# EAGLE design transmitter4 (EAGLE 5.10)
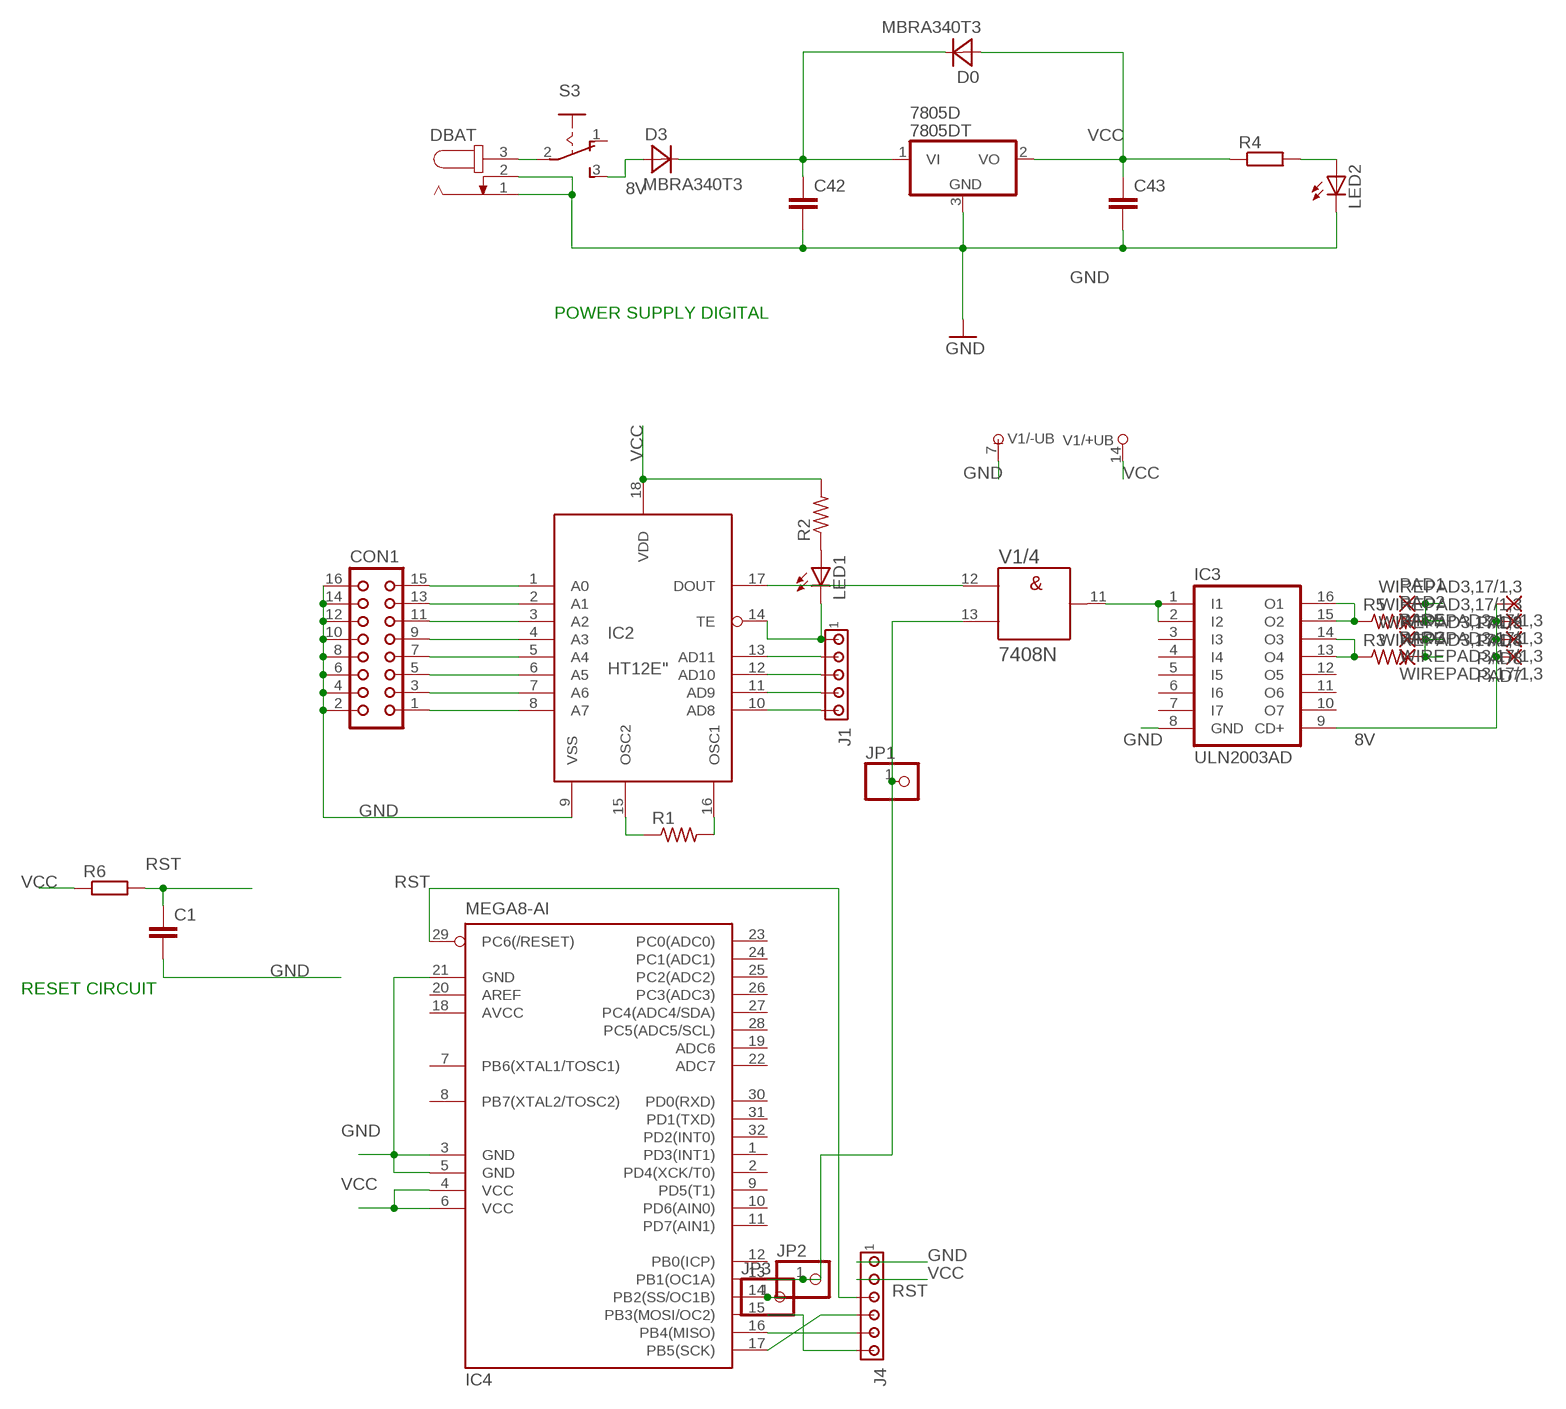
[diagram p0: schematic, sheet 1]

## Parts
7805D  7805DT  [TO252]
C1  C-EUC0603  [C0603]
C42  C-EUC0603  [C0603]
C43  C-EUC0603  [C0603]
CON1  CON16  [CON16]
D0  MBRA340T3  [SMA]
D3  MBRA340T3  [SMA]
DBAT  JACK-PLUG0  [SPC4077]
IC2  HT12E"  [18-DIP-A]
IC3  ULN2003AD  [SO16]
IC4  MEGA8-AI  [TQFP32-08]
J1  MTA05-100  [10X05MTA]
J4  MTA06-100  [10X06MTA]
JP1  PINHD-1X1  [1X01]
JP2  PINHD-1X1  [1X01]
JP3  PINHD-1X1  [1X01]
LED1  LED3MM  [LED3MM]
LED2  LED3MM  [LED3MM]
PAD1  WIREPAD3,17/1,3  [3,17/1,3]
PAD2  WIREPAD3,17/1,3  [3,17/1,3]
PAD3  WIREPAD3,17/1,3  [3,17/1,3]
PAD4  WIREPAD3,17/1,3  [3,17/1,3]
PAD5  WIREPAD3,17/1,3  [3,17/1,3]
PAD7  WIREPAD3,17/1,3  [3,17/1,3]
PAD8  WIREPAD3,17/1,3  [3,17/1,3]
PAD9  WIREPAD3,17/1,3  [3,17/1,3]
R1  R-US_VMTA55  [VMTA55]
R2  R-US_M1206  [M1206]
R3  R-US_0309/12  [0309/12]
R4  R-EU_R0603  [R0603]
R5  R-US_0309/12  [0309/12]
R6  R-EU_R0603  [R0603]
S3  255SB  [255SB]
V1  7408N  [DIL14]

## Nets
8V: D3.A IC3.9(CD+) PAD4.1(P) PAD7.1(P) PAD8.1(P) PAD9.1(P) S3.3(S)
GND: 7805D.3(GND) C1.2 C42.2 C43.2 CON1.2 CON1.4 CON1.6 CON1.8 CON1.10 CON1.12 CON1.14 CON1.16 DBAT.1 DBAT.2 IC2.9(VSS) IC3.8(GND) IC4.3(GND) IC4.5(GND) IC4.21(GND) J4.6 LED2.K(C) V1.7(/-UB:-UB)
N$1: CON1.15 IC2.1(A0)
N$2: CON1.13 IC2.2(A1)
N$3: CON1.11 IC2.3(A2)
N$4: CON1.9 IC2.4(A3)
N$5: CON1.7 IC2.5(A4)
N$6: DBAT.3 S3.2(P)
N$7: IC3.15(O2) IC3.16(O1) R5.1
N$8: LED2.A R4.2
N$9: CON1.5 IC2.6(A5)
N$10: CON1.3 IC2.7(A6)
N$11: CON1.1 IC2.8(A7)
N$12: IC2.13(AD11) J1.2
N$13: IC2.12(AD10) J1.3
N$14: IC2.11(AD9) J1.4
N$15: IC2.10(AD8) J1.5
N$16: IC2.16(OSC1) R1.2
N$17: IC2.15(OSC2) R1.1
N$18: IC4.13(PB1(OC1A)) JP1.1 JP2.1 V1.13(/4:B)
N$19: IC4.14(PB2(SS/OC1B)) JP3.1
N$20: IC3.13(O4) IC3.14(O3) R3.1
N$21: PAD3.1(P) PAD5.1(P) R3.2
N$22: IC2.17(DOUT) V1.12(/4:A)
N$24: LED1.A R2.1
N$25: IC3.1(I1) IC3.2(I2) V1.11(/4:Y)
N$26: IC4.15(PB3(MOSI/OC2)) J4.1
N$27: PAD1.1(P) PAD2.1(P) R5.2
N$28: IC4.16(PB4(MISO)) J4.2
N$29: IC4.17(PB5(SCK)) J4.3
RST: C1.1 IC4.29(PC6(/RESET)) J4.4 R6.2
TE: IC2.14(TE) J1.1 LED1.K(C)
VCC: 7805D.2(VO) C43.1 D0.A IC2.18(VDD) IC4.4(VCC) IC4.6(VCC) J4.5 R2.2 R4.1 R6.1 V1.14(/+UB:+UB)
VI(5D): 7805D.1(VI) C42.1 D0.C D3.C
Unconnected: IC3.3(I3) IC3.4(I4) IC3.5(I5) IC3.6(I6) IC3.7(I7) IC3.10(O7) IC3.11(O6) IC3.12(O5) IC4.1(PD3(INT1)) IC4.2(PD4(XCK/T0)) IC4.7(PB6(XTAL1/TOSC1)) IC4.8(PB7(XTAL2/TOSC2)) IC4.9(PD5(T1)) IC4.10(PD6(AIN0)) IC4.11(PD7(AIN1)) IC4.12(PB0(ICP)) IC4.19(ADC6) IC4.20(AREF) IC4.22(ADC7) IC4.23(PC0(ADC0)) IC4.24(PC1(ADC1)) IC4.25(PC2(ADC2)) IC4.26(PC3(ADC3)) IC4.27(PC4(ADC4/SDA)) IC4.28(PC5(ADC5/SCL)) IC4.30(PD0(RXD)) IC4.31(PD1(TXD)) IC4.32(PD2(INT0)) S3.1(O) V1.1(/1:A) V1.2(/1:B) V1.3(/1:Y) V1.4(/2:A) V1.5(/2:B) V1.6(/2:Y) V1.8(/3:Y) V1.9(/3:A) V1.10(/3:B)

## Notes on the sheet
- POWER SUPPLY DIGITAL
- RESET CIRCUIT

## Power pins joined to a net without a drawn wire
AVCC: IC4.18(AVCC)

## Library data of the parts
7805D = linear:78*: Positive VOLTAGE REGULATOR Source: http://cache.national.com/ds/LM/LM78L05.pdf http://www.fairchildsemi.com/ds/LM/LM7805.pdf
C1 C42 C43 = rcl:C-EU: CAPACITOR, European symbol
CON1 = con-harting:CON16: CONNECTOR
D0 D3 = diode:MBRA340T3: Surface Mount Schottky Power Rectifier Source: http://www.onsemi.com/pub_link/Collateral/MBRA340T3-D.PDF
DBAT = con-jack:JACK-PLUG: DC POWER JACK Power Jack, DC, Right Angle, Through Hole, Rated 5A at 16VDC, PC Terminals Distributor: Farnell (www.Farnell.de) Drawing: 84N1161.pdf / 84N1162.pdf Manufacturer: SPC Technology (www.spctechnology.com) Type: SPC4077 / SPC 4078
IC2 = holtek (2):HT12E: transmitter = encoder ic
IC3 = uln-udn:ULN2003A: DRIVER ARRAY
IC4 = atmel:MEGA8: MICROCONTROLLER 8 Kbytes FLASH, 1 kbytes SRAM, 512 bytes EEPROM, USART, 6-channel 10 bit ADC, 2-channel 8 bit ADC Pin compatible with Atmega48, ATMega88, ATMega168 Source: avr.lbr
J1 = con-amp:MTA05-100: AMP connector
J4 = con-amp:MTA06-100: AMP connector
JP1-JP3 = pinhead:PINHD-1X1: PIN HEADER
LED1 LED2 = led:LED: LED OSRAM: - CHIPLED LG R971, LG N971, LY N971, LG Q971, LY Q971, LO R971, LY R971 LH N974, LH R974 LS Q976, LO Q976, LY Q976 LO Q996 - Hyper CHIPLED LW Q18S LB Q993, LB Q99A, LB R99A - SideLED LS A670, LO A670, LY A670, LG A670, LP A670 LB A673, LV A673, LT A673, LW A673 LH A674 LY A675 LS A676, LA A676, LO A676, LY A676, LW A676 LS A679, LY A679, LG A679 - Hyper Micro SIDELED® LS Y876, LA Y876, LO Y876, LY Y876 LT Y87S - SmartLED LW L88C, LW L88S LB L89C, LB L89S, LG L890 LS L89K, LO L89K, LY L89K LS L896, LA L896, LO L896, LY L896 - TOPLED LS T670, LO T670, LY T670, LG T670, LP T670 LSG T670, LSP T670, LSY T670, LOP T670, LYG T670 LG T671, LOG T671, LSG T671 LB T673, LV T673, LT T673, LW T673 LH T674 LS T676, LA T676, LO T676, LY T676, LB T676, LH T676, LSB T676, LW T676 LB T67C, LV T67C, LT T67C, LS T67K, LO T67K, LY T67K, LW E67C LS E67B, LA E67B, LO E67B, LY E67B, LB E67C, LV E67C, LT E67C LW T67C LS T679, LY T679, LG T679 LS T770, LO T770, LY T770, LG T770, LP T770 LB T773, LV T773, LT T773, LW T773 LH T774 LS E675, LA E675, LY E675, LS T675 LS T776, LA T776, LO T776, LY T776, LB T776 LHGB T686 LT T68C, LB T68C - Hyper Mini TOPLED® LB M676 - Mini TOPLED Santana® LG M470 LS M47K, LO M47K, LY M47K Source: http://www.osram.convergy.de LUXEON: - LUMILED® LXK2-PW12-R00, LXK2-PW12-S00, LXK2-PW14-U00, LXK2-PW14-V00 LXK2-PM12-R00, LXK2-PM12-S00, LXK2-PM14-U00 LXK2-PE12-Q00, LXK2-PE12-R00, LXK2-PE12-S00, LXK2-PE14-T00, LXK2-PE14-U00 LXK2-PB12-K00, LXK2-PB12-L00, LXK2-PB12-M00, LXK2-PB14-N00, LXK2-PB14-P00, LXK2-PB14-Q00 LXK2-PR12-L00, LXK2-PR12-M00, LXK2-PR14-Q00, LXK2-PR14-R00 LXK2-PD12-Q00, LXK2-PD12-R00, LXK2-PD12-S00 LXK2-PH12-R00, LXK2-PH12-S00 LXK2-PL12-P00, LXK2-PL12-Q00, LXK2-PL12-R00 Source: www.luxeon.com KINGBRIGHT: KA-3528ASYC Source: www.kingbright.com
PAD1-PAD5 PAD7-PAD9 = wirepad:WIREPAD: Wire PAD connect wire on PCB
R1-R3 R5 = rcl:R-US_: RESISTOR, American symbol
R4 R6 = resistor:R-EU_: RESISTOR, European symbol
S3 = switch:255SB: SLIDING SWITCH Distributor Buerklin, 11G810
V1 = 74ttl-din:74*08: Quad 2-input AND gate

## Board
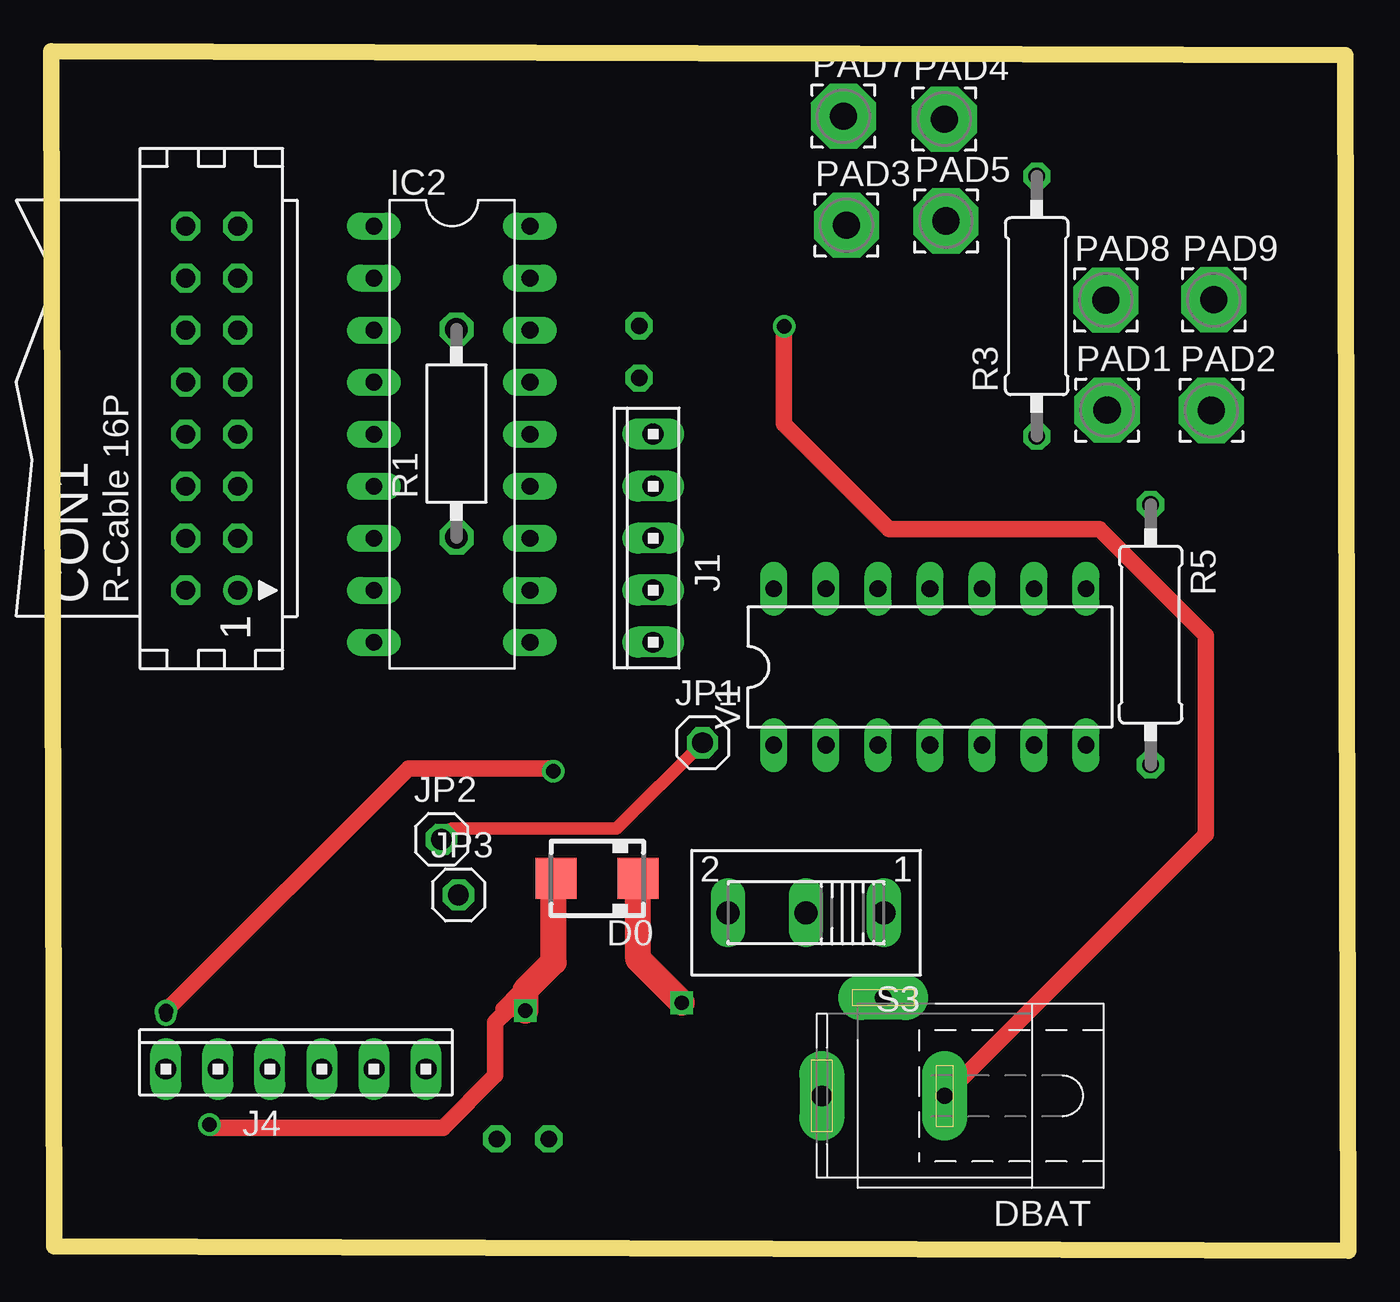
[diagram p1: board, top side]
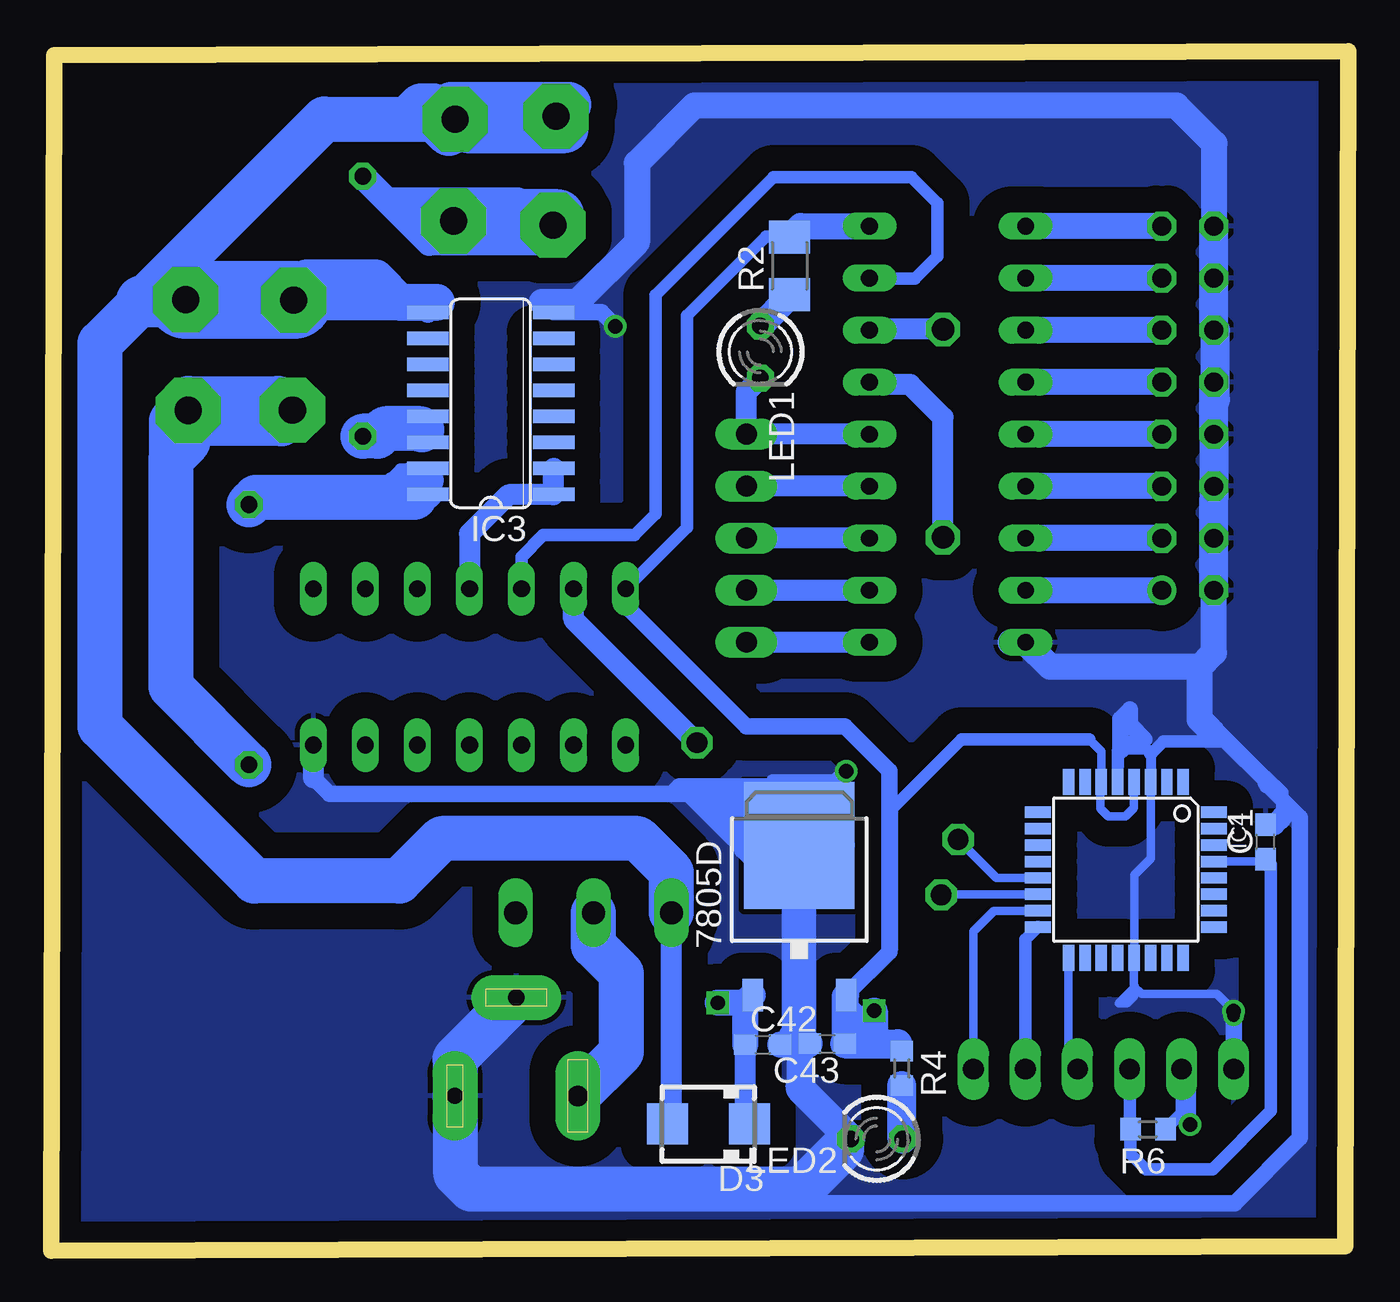
[diagram p2: board, bottom side, seen from below]

Size 63.32 x 58.55 mm. Coordinates in mm from the lower left corner, seen from the top.
Outline: 0.16,0.2 63.32,0 63.16,58.35 0,58.55 0.16,0.2
Copper layers (1*16): Top 0.035mm / dielectric 1.5mm / Bottom 0.035mm
Design rules "default *": minimum track width 10mil, minimum drill 24mil, track to track 50mil, track to pad 50mil, pad to pad 50mil, via to via 50mil, smd to smd 50mil, copper to edge 40mil, drill to drill 8mil, minimum pad ring 10mil, minimum via ring 8mil, stop-mask expansion 4mil, vias tented up to drill 0mil, thermal gap 10mil

### Footprints (pad centres in the part's own frame; a part is rotated, then mirrored left to right if it is on the bottom)
TO252 = smd 1 x 1.6: 1 -2.28,-4.8; 2 2.28,-4.8 | smd 5.4 x 6.2: 3 0,2.5
C0603 = smd 1.1 x 1: 1 -0.85,0; 2 0.85,0
CON16 = drill 0.914 round: 1 -8.89,-1.27 | drill 0.914 octagon: 2 -8.89,1.27; 3 -6.35,-1.27; 4 -6.35,1.27; 5 -3.81,-1.27; 6 -3.81,1.27; 7 -1.27,-1.27; 8 -1.27,1.27; 9 1.27,-1.27; 10 1.27,1.27; 11 3.81,-1.27; 12 3.81,1.27; 13 6.35,-1.27; 14 6.35,1.27; 15 8.89,-1.27; 16 8.89,1.27
SMA = smd 2 x 2: A 2,0; C -2,0
SPC4077 = drill 0.8 pad 2.184 long: 1 -3,0; 2 0,-4.8 | drill 1 pad 2.184 long: 3 3,0
18-DIP-A = drill 0.813 long: 1 -10.16,-3.81; 2 -7.62,-3.81; 3 -5.08,-3.81; 4 -2.54,-3.81; 5 0,-3.81; 6 2.54,-3.81; 7 5.08,-3.81; 8 7.62,-3.81; 9 10.16,-3.81; 10 10.16,3.81; 11 7.62,3.81; 12 5.08,3.81; 13 2.54,3.81; 14 0,3.81; 15 -2.54,3.81; 16 -5.08,3.81; 17 -7.62,3.81; 18 -10.16,3.81
SO16 = smd 0.66 x 2.032: 1 -4.445,-3.073; 2 -3.175,-3.073; 3 -1.905,-3.073; 4 -0.635,-3.073; 5 0.635,-3.073; 6 1.905,-3.073; 7 3.175,-3.073; 8 4.445,-3.073; 9 4.445,3.073; 10 3.175,3.073; 11 1.905,3.073; 12 0.635,3.073; 13 -0.635,3.073; 14 -1.905,3.073; 15 -3.175,3.073; 16 -4.445,3.073
TQFP32-08 = smd 1.27 x 0.559: 1 -4.293,2.8; 2 -4.293,2; 3 -4.293,1.2; 4 -4.293,0.4; 5 -4.293,-0.4; 6 -4.293,-1.2; 7 -4.293,-2; 8 -4.293,-2.8; 17 4.293,-2.8; 18 4.293,-2; 19 4.293,-1.2; 20 4.293,-0.4; 21 4.293,0.4; 22 4.293,1.2; 23 4.293,2; 24 4.293,2.8 | smd 0.559 x 1.27: 9 -2.8,-4.293; 10 -2,-4.293; 11 -1.2,-4.293; 12 -0.4,-4.293; 13 0.4,-4.293; 14 1.2,-4.293; 15 2,-4.293; 16 2.8,-4.293; 25 2.8,4.293; 26 2,4.293; 27 1.2,4.293; 28 0.4,4.293; 29 -0.4,4.293; 30 -1.2,4.293; 31 -2,4.293; 32 -2.8,4.293
10X05MTA = drill 1.016 long: 1 5.08,0; 2 2.54,0; 3 0,0; 4 -2.54,0; 5 -5.08,0
10X06MTA = drill 1.016 long: 1 6.35,0; 2 3.81,0; 3 1.27,0; 4 -1.27,0; 5 -3.81,0; 6 -6.35,0
1X01 = drill 1.016 octagon: 1 0,0
LED3MM = drill 0.813 octagon: A -1.27,0; K 1.27,0
3,17/1,3 = drill 1.321 pad 3.175 octagon: 1 0,0
VMTA55 = drill 1.1 octagon: 1 -5.08,0; 2 5.08,0
M1206 = smd 1.6 x 2: 1 -1.4,0; 2 1.4,0
0309/12 = drill 0.813 octagon: 1 -6.35,0; 2 6.35,0
R0603 = smd 1 x 1.1: 1 -0.85,0; 2 0.85,0
255SB = drill 1.118 long: 1 -3.81,0; 2 0,0; 3 3.81,0
DIL14 = drill 0.813 long: 1 -7.62,-3.81; 2 -5.08,-3.81; 3 -2.54,-3.81; 4 0,-3.81; 5 2.54,-3.81; 6 5.08,-3.81; 7 7.62,-3.81; 8 7.62,3.81; 9 5.08,3.81; 10 2.54,3.81; 11 0,3.81; 12 -2.54,3.81; 13 -5.08,3.81; 14 -7.62,3.81

### Placement (x,y rotation side)
7805D  26.8,17.27 0 bottom
C1  4.03,19.95 90 bottom
C42  28.58,10.05 0 bottom
C43  25.44,10.09 180 bottom
CON1  7.83,41.12 90 top
D0  26.65,18.17 180 top
D3  31.24,6.18 180 bottom
DBAT  40.61,7.55 180 top
IC2  19.56,39.85 270 top
IC3  41.86,41.36 90 bottom
IC4  10.86,18.59 270 bottom
J1  29.39,34.78 90 top
J4  11.95,8.86 0 top
JP1  31.79,24.79 0 top
JP2  19.05,20.07 0 top
JP3  19.88,17.36 0 top
LED1  28.7,43.87 270 bottom
LED2  23.02,5.45 180 bottom
PAD1  51.54,41.03 0 top
PAD2  56.63,41.02 0 top
PAD3  38.82,50.06 0 top
PAD4  43.6,55.24 0 top
PAD5  43.68,50.26 0 top
PAD7  38.67,55.38 0 top
PAD8  51.48,46.41 0 top
PAD9  56.75,46.41 0 top
R1  19.79,39.89 90 top
R2  27.27,48.07 90 bottom
R3  48.11,46.1 90 top
R4  21.8,8.89 270 bottom
R5  53.67,30.06 270 top
R6  9.78,5.92 180 bottom
S3  36.85,16.49 180 top
V1  42.9,28.49 0 top

### Tracks (layer width: path | path; a pad name or v marks a point on that pad's centre or on a via)
8V
  Bottom 1.016: 51.47,46.3 45.43,46.3 IC3.9 | D3.A 33.04,6.38 S3.3
  Bottom 1.676: 50.9,46.95 50.9,47.44 50.85,47.49
  Bottom 1.778: 50.85,47.49 47.49,47.49 46.28,46.28 44.52,46.28 44.5,46.3 51.47,46.3
  Bottom 2.184: 56.82,46.34 PAD9.1 | PAD4.1 49.99,55.24 58.89,46.34 60.93,44.3 60.93,25.58 53.39,18.04 46.33,18.04 44.26,20.11 34.68,20.11 33.04,18.47 S3.3 | PAD4.1 44.01,55.24 44.64,55.87 45.28,55.87 45.58,55.57 44.96,55.57 43.92,54.53 43.92,55.81 43.78,55.95 38.06,55.95 | PAD7.1 38.19,54.7 38.22,54.67 43.03,54.67 PAD4.1
  Bottom 2.54: 58.89,46.34 56.82,46.34 | PAD8.1 51.44,46.41 50.9,46.95
  Bottom 3.81: PAD9.1 PAD8.1
GND  (via drill 0.6, 0.7)
  Top 0.813: v5.6,11.47 v5.6,11.69 17.45,23.54 24.37,23.54 v24.51,23.4 | v35.78,45.12 35.78,40.35 40.9,35.23 51.17,35.23 56.37,30.03 56.37,20.31 DBAT.1
  Bottom 0.406: 10.48,14.28 IC4.21 10.46,12.9 10.08,12.52 6.43,12.52 v5.6,11.69 | 9.59,24.3 9.59,22.95 IC4.3 | IC4.5 11.26,23.31 11.18,23.39 11.3,23.39 11.36,23.45 11.36,23.97 11.35,23.98 11.35,23.84 11.15,23.64 11.15,24.09 | IC4.3 9.66,24.24 | 11.15,24.09 11.15,24.42 11.19,24.46 | 10.44,14.74 10.44,18.34 9.64,19.14 9.64,23 | 9.64,23 9.67,23.03 | 10.45,12.94 10.45,12.81 11.2,12.06 10.82,12.06 10.44,12.44 | 9.64,23 9.66,22.98 IC4.3 | 9.88,24.42 10.82,24.42 11.15,24.09 | 11.15,24.09 11.18,24.06
  Bottom 0.61: 4.03,22.83 6.07,24.86 | 6.74,24.86 9.03,24.86 9.59,24.3 | 6.07,24.86 6.74,24.86 | 9.66,24.24 9.66,24.29 10.19,24.82 10.83,24.82 11.19,24.46 | 6.74,24.86 6.74,25.19 | 6.74,25.19 arc90 6.4,25.53 6.4,25.4 | 6.4,25.4 6.4,25.19 arc-90 6.07,24.86 | 6.74,25.19 6.74,25.41 | 4.03,23.15 6.36,25.48 6.36,25.44 arc90 6.4,25.4 | 4.03,23.15 4.03,22.62 | 3.23,21.17 3.23,22.35 4.03,23.15 | 39.37,46.3 38.89,45.82 37.57,45.82 37.59,45.8 | 6.54,36.77 6.56,36.78 CON1.6 | 34.57,22.28 34.48,22.19 31.72,22.19 31.15,22.76 28.3,22.76 28.11,22.95 24.96,22.95
  Bottom 0.813: 6.48,44.93 CON1.12 | 6.48,41.55 6.56,41.55 CON1.10 | 6.54,39.85 CON1.8 | 6.56,36.77 6.54,36.77 | CON1.2 6.5,32.23 | 32.68,22.66 arc45 32.5,22.59 29.72,19.8 26.87,19.8 arc45 7805D.3 | 32.68,22.66 30.21,22.66 arc45 30.03,22.59 28.71,21.27 28.06,20.61 29.5,20.61 arc-45 29.62,20.56 arc-45 29.65,20.65 31.18,22.17 30.53,22.17 arc45 30.35,22.1 30.29,22.03 arc-45 30.23,21.89 29.6,21.26 arc45 29.46,21.2 29.26,21 29.26,20.05 arc45 29.33,19.87 29.6,19.6 arc-45 29.57,19.53 28.71,18.67 | J4.6 v5.6,11.47 | v24.51,23.4 24.96,22.95 25.64,22.27 26.44,22.27 | 4.03,22.83 2.36,21.15 2.36,5.5 5.55,2.31 26.85,2.31 26.38,2.78 26.38,3.3 | 32.68,22.66 33.04,22.3 49.74,22.3 50.52,23.08 | IC3.8 36.46,45.8 v35.78,45.12 | 11.13,24.42 11.13,25.96 10.67,26.42 10.67,25.67 9.95,24.95
  Bottom 1.016: 24.72,4.96 24.72,5.02 LED2.K | C1.2 3.6,20.8 3.23,21.17 | 50.52,23.08 V1.7
  Bottom 1.27: C42.2 26.33,10.05 C43.2 | C43.2 27.02,10.1 27.06,10.13 | C43.2 26.72,10.1 26.76,10.06 26.76,8.07 | CON1.2 6.56,29.19 7.26,28.49 | 7.26,28.49 14.55,28.49 IC2.9 16.49,29.69 | 26.44,22.27 27.71,22.27 28.71,21.27 | 7.26,28.49 7.26,25.93 6.74,25.41 | CON1.16 6.54,50.03 6.54,54.04 8.39,55.89 31.93,55.89 34.73,53.09 34.73,49.21 37.64,46.3 39.37,46.3
  Bottom 1.422: CON1.16 CON1.14 CON1.12 | 6.48,41.55 6.48,44.93 | CON1.8 CON1.10 | 6.54,36.77 6.54,39.85 | 6.56,36.77 CON1.4 CON1.2 | 26.76,8.07 26.76,8.02 arc-45 26.68,7.84 LED2.K
  Bottom 1.676: 27.06,10.13 27.06,10.24 27,10.3 27,10.37 26.9,10.47 26.88,10.47 26.81,10.4 7805D.3
  Bottom 2.184: DBAT.1 43.61,9.35 DBAT.2 40.63,12.35 43.57,9.41 43.57,3.74 42.83,3 26.68,3 26.38,3.3 24.72,4.96
  pour Bottom: 1.57,1.05 1.57,57.25 61.86,57.25 61.86,1.05
N$1
  Bottom 1.27: CON1.15 IC2.1
N$2
  Bottom 1.27: CON1.13 IC2.2
N$3
  Bottom 1.27: CON1.11 IC2.3
N$4
  Bottom 1.27: CON1.9 IC2.4
N$5
  Bottom 1.27: CON1.7 IC2.5
N$6
  Bottom 2.184: S3.2 36.85,14.89 35.49,13.53 35.49,9.68 DBAT.3
N$7
  Bottom 0.61: IC3.16 45.97,36.91 46.74,37.68 46.71,37.68 46.26,38.13 44.99,38.13 IC3.15
  Bottom 1.422: IC3.16 44.94,37.53 44.87,37.6 45.27,37.6 45.27,36.86 45.32,36.81 45.32,37.41 45.71,37.8 45.71,36.88 45.59,36.76
  Bottom 2.184: 45.59,36.76 53.32,36.76 R5.1
N$8
  Bottom 1.422: R4.2 21.8,5.56 arc-45 LED2.A
N$9
  Bottom 1.27: CON1.5 IC2.6
N$10
  Bottom 1.27: CON1.3 IC2.7
N$11
  Bottom 1.27: CON1.1 IC2.8
N$12
  Bottom 1.016: IC2.13 J1.2
N$13
  Bottom 1.016: IC2.12 J1.3
N$14
  Bottom 1.016: IC2.11 J1.4
N$15
  Bottom 1.016: IC2.10 J1.5
N$16
  Bottom 1.016: R1.2 23.33,44.97 IC2.16
N$17
  Bottom 1.016: R1.1 19.79,40.67 21.4,42.28 23.26,42.28 IC2.15
N$18
  Top 0.61: JP1.1 27.61,20.6 19.58,20.6 JP2.1
  Bottom 0.406: IC4.13 17.17,18.19 JP2.1
  Bottom 1.016: JP1.1 37.82,30.81 V1.13
N$19
  Bottom 0.406: IC4.14 19.85,17.39 JP3.1
N$20
  Bottom 0.61: 45.22,40.06 45.22,39.74 IC3.14 IC3.13
  Bottom 2.184: R3.1 47.39,39.75 47.02,40.12 45.28,40.12 45.22,40.06
N$21
  Bottom 1.27: R3.2 44.86,49.2 38.48,49.2 40.54,51.26 46.76,51.26 45.56,50.06 PAD3.1
  Bottom 2.54: PAD5.1 43.57,50.26 43.29,50.54 38.57,50.54 PAD3.1
N$22
  Bottom 0.61: IC2.17 23.34,47.44 21.15,47.44 20.05,48.54 20.05,51.12 21.32,52.39 28.05,52.39 33.81,46.63 33.81,35.96 34.85,34.92 39.3,34.92 40.36,33.86 V1.12
N$23
  Bottom 0.406: 11.17,24.47 11.28,24.47 11.3,24.45 11.3,24.43 11.31,24.42 11.31,24.44 11.32,24.45 11.32,24.43 11.35,24.4 11.35,23.74
N$24
  Bottom 1.27: R2.1 27.27,46.57 LED1.A
N$25
  Bottom 1.016: IC3.2 IC3.1 40.99,36.9 42.9,34.99 V1.11
N$26
  Bottom 0.406: J4.1 18.3,15.58 17.29,16.59 IC4.15
N$27
  Bottom 2.184: PAD1.1 51.67,41.03 52.25,41.6 56.63,41.6 56.63,40.52 56.47,40.36 52.09,40.36 51.47,40.98 56.6,40.98 PAD2.1 56.63,39.48 57.45,38.66 | R5.2 57.47,27.51 57.47,38.64 57.45,38.66 | 56.8,41.16 57.45,40.51 57.45,38.66
N$28
  Bottom 0.61: IC4.16 15.76,15.19 J4.2
N$29
  Bottom 0.406: J4.3 13.66,9.3 IC4.17
RST
  Bottom 0.406: IC4.29 4.14,18.99 C1.1
  Bottom 0.61: C1.1 3.78,18.84 3.78,6.81 6.62,3.97 9.89,3.97 10.63,4.71 R6.2 10.68,5.97 J4.4
TE
  Bottom 1.016: IC2.14 J1.1 29.39,41.92 LED1.K
VCC  (via drill 0.7)
  Top 0.61: 23.14,12.69 22.84,12.69 21.98,11.83 22.24,11.83 22.27,11.8 22.58,11.8 22.96,11.42
  Top 0.813: v7.73,6.15 7.88,6 19.14,6 21.68,8.54 21.68,11.14 22.27,11.73 22.27,11.8
  Top 1.27: v23.14,11.71 23.14,12.69 24.53,14.08 24.53,18.04 D0.A
  Bottom 0.406: IC4.6 12.06,24.37 12.64,24.95 | IC4.4 10.46,21.6 10.88,21.18 11.71,21.18 12.1,21.57 12.1,22.84 IC4.6 | IC4.6 12.09,22.85
  Bottom 0.61: J4.5 8.04,8.76 | 12.64,24.95 18.88,24.95 22.27,21.56 22.27,14.72 7805D.2 | V1.14 32.29,35.29 32.29,45.63 28.43,49.49 27.3,49.49 R2.2 | R6.1 8.14,6.71 J4.5 | J4.5 7.73,8.45 v7.73,6.15
  Bottom 0.813: 7805D.2 22.4,14.59 22.4,23.4 24.58,25.58 29.38,25.58 35.28,31.48 V1.14
  Bottom 1.016: R4.1 21.8,9.8 arc-45 21.87,9.98 22,10.1
  Bottom 1.27: C43.1 24.59,12.4 7805D.2 24.52,11.8 23.12,10.4 23.12,11.69 v23.14,11.71 | IC2.18 26.73,50.01 R2.2
  Bottom 1.422: 22,10.1 24.57,10.1 arc-45 C43.1
VI(5D)  (via drill 0.7)
  Top 1.27: D0.C 28.65,14.23 v30.79,12.09
  Bottom 1.016: C42.1 29.43,6.36 D3.C
  Bottom 1.27: C42.1 29.43,11.98 | 29.43,11.98 29.43,12.12 7805D.1 | v30.79,12.09 29.54,12.09 29.43,11.98